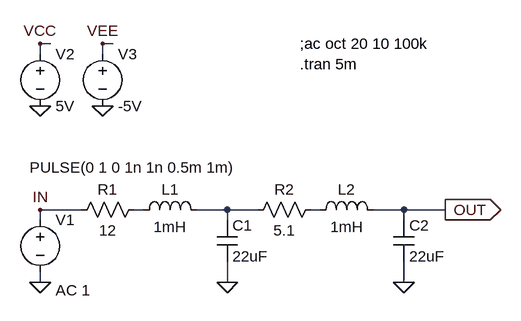
[diagram p0: schematic 4thButterWorthLPF_1mH_NoBuffer.asc]
4thButterWorthLPF_1mH_NoBuffer.asc, the LTspice schematic file:
Version 4
SHEET 1 964 680
WIRE -32 -128 -48 -128
WIRE 64 -128 48 -128
WIRE -48 -112 -48 -128
WIRE 48 -112 48 -128
WIRE 16 128 -48 128
WIRE 112 128 96 128
WIRE 240 128 192 128
WIRE 288 128 240 128
WIRE 384 128 368 128
WIRE 512 128 464 128
WIRE 576 128 512 128
WIRE -48 144 -48 128
WIRE 240 144 240 128
WIRE 512 144 512 128
WIRE -48 240 -48 224
WIRE 240 240 240 208
WIRE 512 240 512 208
FLAG 240 240 0
FLAG -48 240 0
FLAG 576 128 OUT
IOPIN 576 128 Out
FLAG 512 240 0
FLAG -48 -32 0
FLAG 48 -32 0
FLAG -48 -128 VCC
FLAG 48 -128 VEE
FLAG -48 128 IN
SYMBOL ind 96 144 R270
WINDOW 0 32 56 VTop 2
WINDOW 3 5 56 VBottom 2
SYMATTR InstName L1
SYMATTR Value 1mH
SYMBOL res 112 112 R90
WINDOW 0 0 56 VBottom 2
WINDOW 3 32 56 VTop 2
SYMATTR InstName R1
SYMATTR Value 12
SYMBOL cap 224 144 R0
SYMATTR InstName C1
SYMATTR Value 22uF
SYMBOL voltage -48 128 R0
WINDOW 123 24 124 Left 2
WINDOW 39 0 0 Left 2
WINDOW 3 -16 -65 Left 2
SYMATTR Value2 AC 1
SYMATTR InstName V1
SYMATTR Value PULSE(0 1 0 1n 1n 0.5m 1m)
SYMBOL ind 368 144 R270
WINDOW 0 32 56 VTop 2
WINDOW 3 5 56 VBottom 2
SYMATTR InstName L2
SYMATTR Value 1mH
SYMBOL res 384 112 R90
WINDOW 0 0 56 VBottom 2
WINDOW 3 32 56 VTop 2
SYMATTR InstName R2
SYMATTR Value 5.1
SYMBOL cap 496 144 R0
SYMATTR InstName C2
SYMATTR Value 22uF
SYMBOL voltage -48 -128 R0
WINDOW 123 0 0 Left 2
WINDOW 39 0 0 Left 2
SYMATTR InstName V2
SYMATTR Value 5V
SYMBOL voltage 48 -128 R0
SYMATTR InstName V3
SYMATTR Value -5V
TEXT 352 -128 Left 2 !;ac oct 20 10 100k
TEXT 352 -96 Left 2 !.tran 5m

The netlist it stands for:
* 4thButterWorthLPF_1mH_NoBuffer.asc
L1 N001 N002 1mH
R1 N001 IN 12
C1 N002 0 22uF
V1 IN 0 PULSE(0 1 0 1n 1n 0.5m 1m) AC 1
L2 N003 OUT 1mH
R2 N003 N002 5.1
C2 OUT 0 22uF
V2 VCC 0 5V
V3 VEE 0 -5V
;ac oct 20 10 100k
.tran 5m
.backanno
.end